# EAGLE design WS2811Controller (EAGLE 6.4)
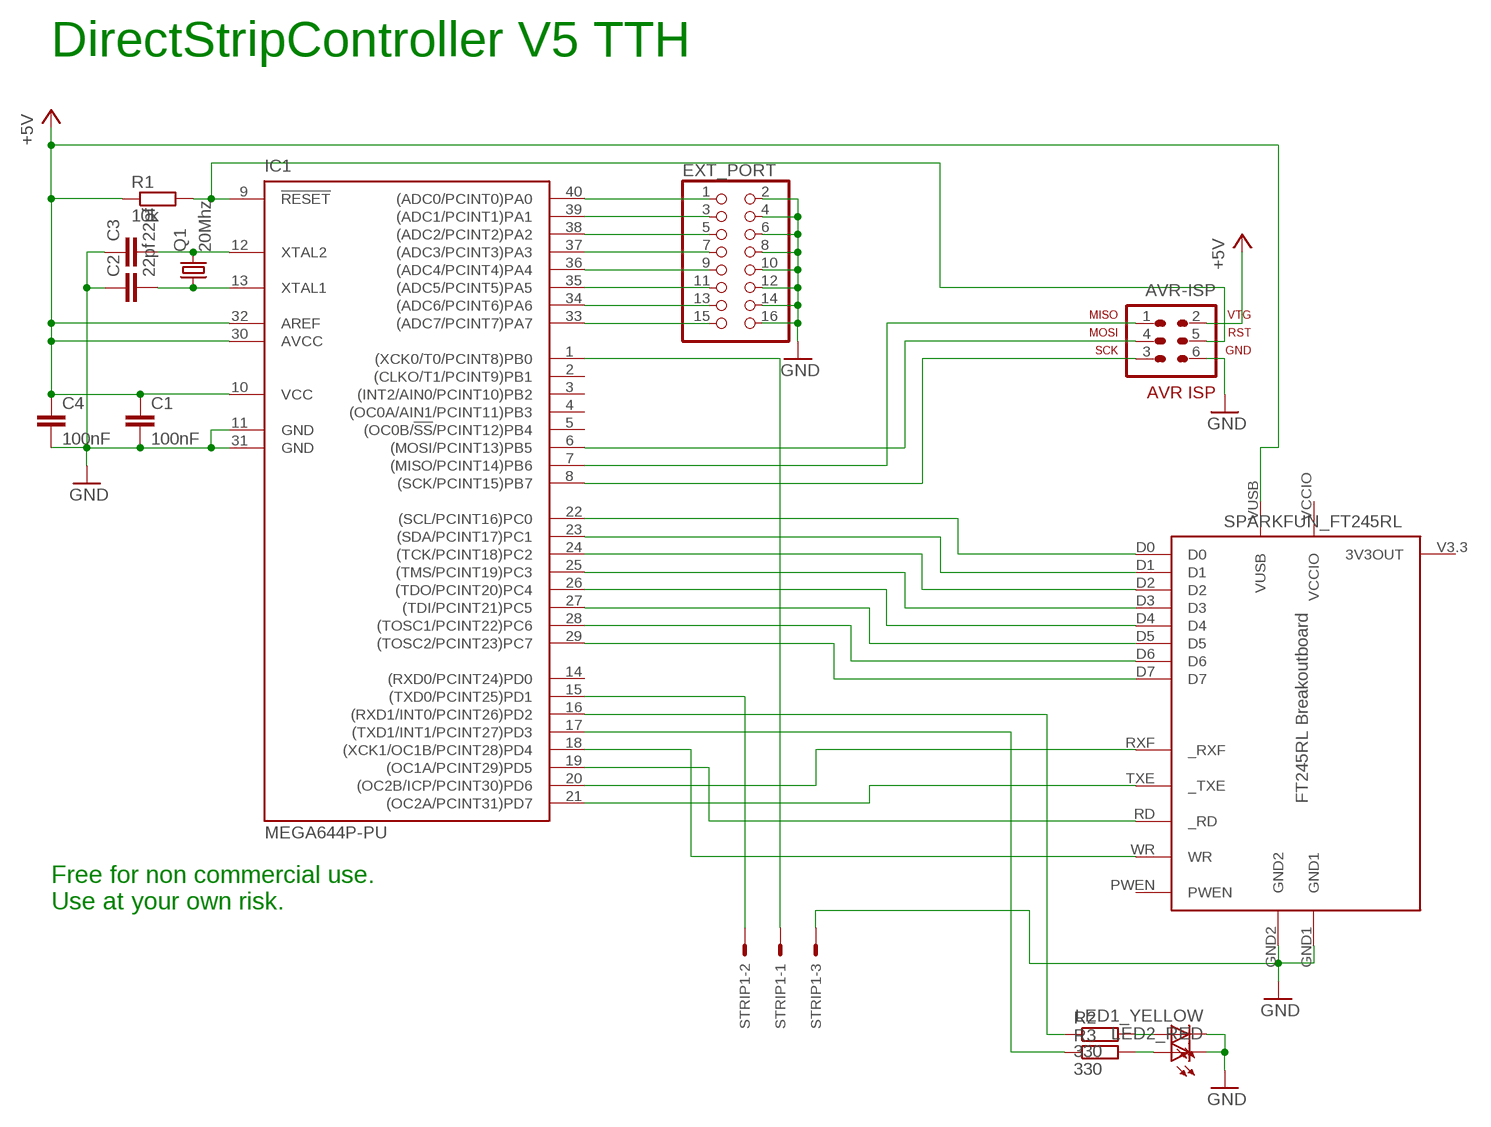
[diagram p0: schematic, sheet 1]

## Parts
AVR-ISP  AVR-ISP-6  [AVR-ISP-6]
C1  100nF  C-EU025-025X050  [C025-025X050]
C2  22pf  C-EU025-025X050  [C025-025X050]
C3  22pf  C-EU025-025X050  [C025-025X050]
C4  100nF  C-EU025-025X050  [C025-025X050]
EXT_PORT  PINHD-2X8  [2X08]
IC1  MEGA644P-PU  MEGA164P/324P/644P-PU  [DIL40]
LED1_YELLOW  LED3MM  [LED3MM]
LED2_RED  LED3MM  [LED3MM]
Q1  20Mhz  CRYSTALHC49U-V  [HC49U-V]
R1  10k  R-EU_0207/10  [0207/10]
R2  330  R-EU_0207/10  [0207/10]
R3  330  R-EU_0207/10  [0207/10]
SPARKFUN_FT245RL  FT245RL_BREAKOUTBOARD  [SPARKFUN_FT245RL_BOARD]
STRIP1  22-27-2031-03  [6410-03]

## Nets
+5V: AVR-ISP.2 C1.1 C4.1 IC1.10(VCC) IC1.30(AVCC) IC1.32(AREF) R1.1 SPARKFUN_FT245RL.VUSB
DATA0: IC1.22((SCL/PCINT16)PC0) SPARKFUN_FT245RL.D0
DATA1: IC1.23((SDA/PCINT17)PC1) SPARKFUN_FT245RL.D1
DATA2: IC1.24((TCK/PCINT18)PC2) SPARKFUN_FT245RL.D2
DATA3: IC1.25((TMS/PCINT19)PC3) SPARKFUN_FT245RL.D3
DATA4: IC1.26((TDO/PCINT20)PC4) SPARKFUN_FT245RL.D4
DATA5: IC1.27((TDI/PCINT21)PC5) SPARKFUN_FT245RL.D5
DATA6: IC1.28((TOSC1/PCINT22)PC6) SPARKFUN_FT245RL.D6
DATA7: IC1.29((TOSC2/PCINT23)PC7) SPARKFUN_FT245RL.D7
GND: AVR-ISP.6 C1.2 C2.1 C3.1 C4.2 EXT_PORT.2 EXT_PORT.4 EXT_PORT.6 EXT_PORT.8 EXT_PORT.10 EXT_PORT.12 EXT_PORT.14 EXT_PORT.16 IC1.11(GND) IC1.31(GND) LED1_YELLOW.K(C) LED2_RED.K(C) SPARKFUN_FT245RL.GND1 SPARKFUN_FT245RL.GND2 STRIP1.3
MISO: AVR-ISP.1 IC1.7((MISO/PCINT14)PB6)
MOSI: AVR-ISP.4 IC1.6((MOSI/PCINT13)PB5)
N$3: IC1.16((RXD1/INT0/PCINT26)PD2) R2.1
N$6: IC1.17((TXD1/INT1/PCINT27)PD3) R3.1
N$8: C2.2 IC1.13(XTAL1) Q1.1
N$9: C3.2 IC1.12(XTAL2) Q1.2
N$21: LED1_YELLOW.A R2.2
N$22: LED2_RED.A R3.2
N$24: EXT_PORT.1 IC1.40((ADC0/PCINT0)PA0)
N$26: EXT_PORT.3 IC1.39((ADC1/PCINT1)PA1)
N$27: EXT_PORT.5 IC1.38((ADC2/PCINT2)PA2)
N$28: EXT_PORT.7 IC1.37((ADC3/PCINT3)PA3)
N$29: EXT_PORT.9 IC1.36((ADC4/PCINT4)PA4)
N$30: EXT_PORT.11 IC1.35((ADC5/PCINT5)PA5)
N$31: EXT_PORT.13 IC1.34((ADC6/PCINT6)PA6)
N$32: EXT_PORT.15 IC1.33((ADC7/PCINT7)PA7)
RD: IC1.19((OC1A/PCINT29)PD5) SPARKFUN_FT245RL.RD(_RD)
RESET: AVR-ISP.5 IC1.9(!RESET) R1.2
RXF: IC1.20((OC2B/ICP/PCINT30)PD6) SPARKFUN_FT245RL.RXF(_RXF)
SCK: AVR-ISP.3 IC1.8((SCK/PCINT15)PB7)
STRIP_CLOCK: IC1.1((XCK0/T0/PCINT8)PB0) STRIP1.1
STRIP_DATA: IC1.15((TXD0/PCINT25)PD1) STRIP1.2
TXE: IC1.21((OC2A/PCINT31)PD7) SPARKFUN_FT245RL.TXE(_TXE)
WR: IC1.18((XCK1/OC1B/PCINT28)PD4) SPARKFUN_FT245RL.WR
Unconnected: IC1.2((CLKO/T1/PCINT9)PB1) IC1.3((INT2/AIN0/PCINT10)PB2) IC1.4((OC0A/AIN1/PCINT11)PB3) IC1.5((OC0B/!SS!/PCINT12)PB4) IC1.14((RXD0/PCINT24)PD0) SPARKFUN_FT245RL.PWEN SPARKFUN_FT245RL.V3.3(3V3OUT)

## Notes on the sheet
- DirectStripController V5 TTH
- Free for non commercial use.
  Use at your own risk.

## Power pins joined to a net without a drawn wire
VCCIO: SPARKFUN_FT245RL.VCCIO

## Library data of the parts
AVR-ISP = 0_avr:AVR-ISP-6: AVR ISP-6 Serial Programming Header
C1-C4 = 0_Standard-Parts:C-EU: CAPACITOR, European symbol
EXT_PORT = 0_pinhead:PINHD-2X8: PIN HEADER
IC1 = 0_avr:MEGA164P/324P/644P-PU
LED1_YELLOW LED2_RED = 0_Led:LED: LED
Q1 = 0_tom parts:CRYSTAL: CRYSTAL; OC_FARNELL: 1666969; OC_NEWARK: unknown
R1-R3 = 0_Standard-Parts:R-EU_: RESISTOR, European symbol
SPARKFUN_FT245RL = Sparkfun:FT245RL_BREAKOUTBOARD: Sparkfun FT245RL Breakoutboard
STRIP1 = con-molex:22-?-03: CONNECTOR wire to board 2.54 mm (.1 inch) pitch header; OC_FARNELL: unknown; OC_NEWARK: unknown

## Board
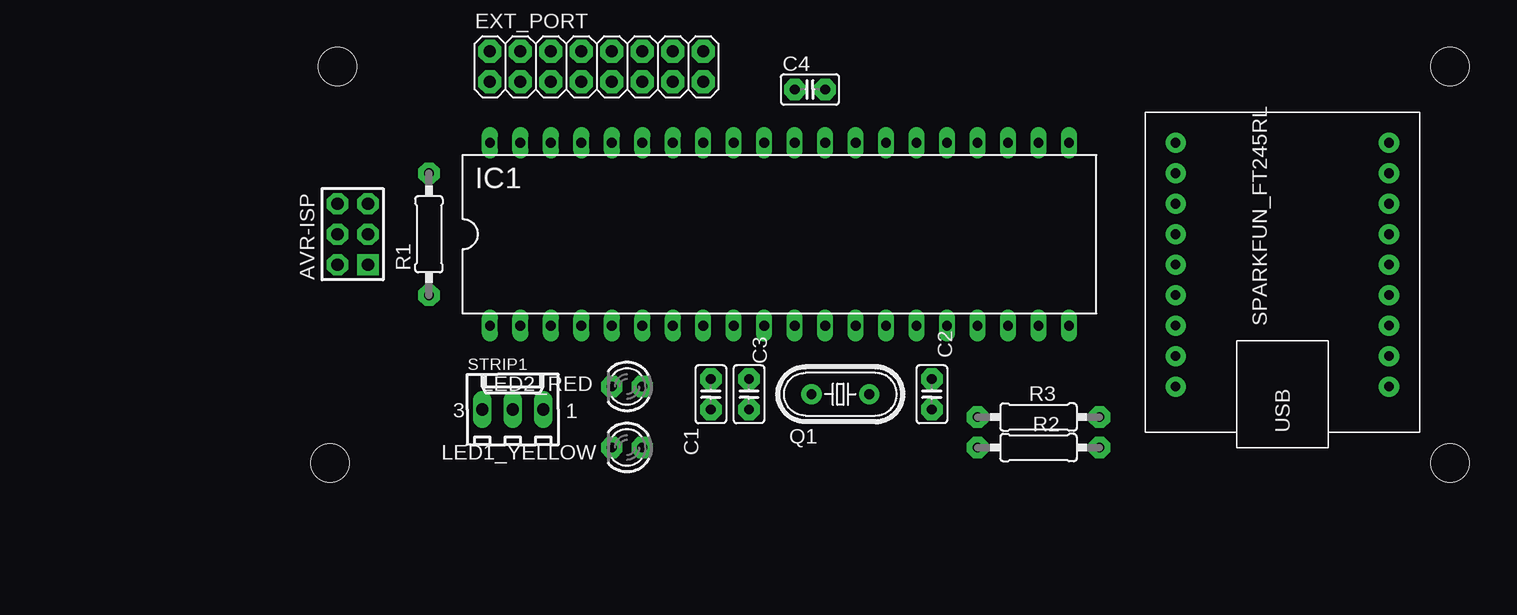
[diagram p1: board, top side]
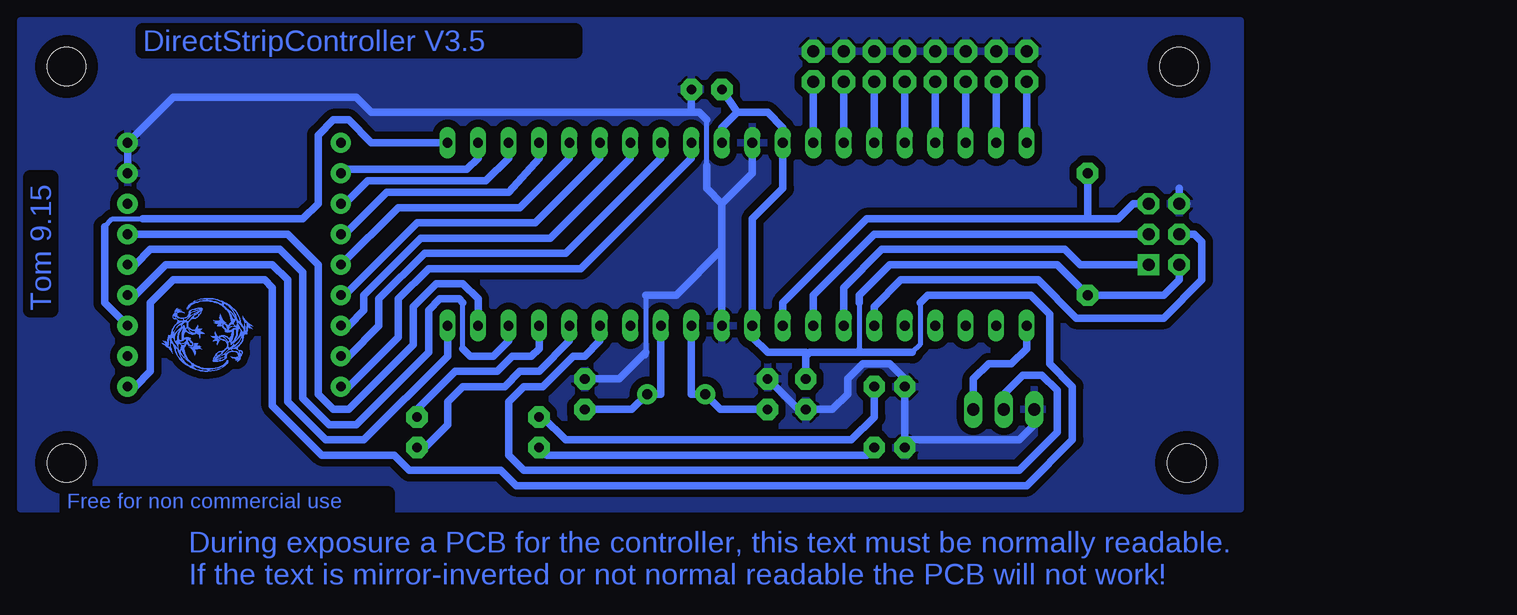
[diagram p2: board, bottom side, seen from below]

No outline drawn. Coordinates in mm, seen from the top.
Copper layers (1*16): Top 0.035mm / dielectric 1.5mm / Bottom 0.035mm
Design rules "default": minimum track width 10mil, minimum drill 24mil, track to track 8mil, track to pad 8mil, pad to pad 8mil, via to via 8mil, smd to smd 8mil, copper to edge 40mil, drill to drill 8mil, minimum pad ring 10mil, minimum via ring 8mil, stop-mask expansion 4mil, vias tented up to drill 0mil, thermal gap 10mil
Holes 3.2 mm at 5.08,36.83 4.45,3.81 97.79,3.81 97.79,36.83

### Footprints (pad centres in the part's own frame; a part is rotated, then mirrored left to right if it is on the bottom)
AVR-ISP-6 = drill 1.016 pad 1.778 square: 1 -2.54,-1.27 | drill 1.016 pad 1.778 octagon: 2 -2.54,1.27; 3 0,-1.27; 4 0,1.27; 5 2.54,-1.27; 6 2.54,1.27
C025-025X050 = drill 0.813 pad 1.778 octagon: 1 -1.27,0; 2 1.27,0
2X08 = drill 1.016 pad 1.93 octagon: 1 -8.89,-1.27; 2 -8.89,1.27; 3 -6.35,-1.27; 4 -6.35,1.27; 5 -3.81,-1.27; 6 -3.81,1.27; 7 -1.27,-1.27; 8 -1.27,1.27; 9 1.27,-1.27; 10 1.27,1.27; 11 3.81,-1.27; 12 3.81,1.27; 13 6.35,-1.27; 14 6.35,1.27; 15 8.89,-1.27; 16 8.89,1.27
DIL40 = drill 0.813 long: 1 -24.13,-7.62; 2 -21.59,-7.62; 3 -19.05,-7.62; 4 -16.51,-7.62; 5 -13.97,-7.62; 6 -11.43,-7.62; 7 -8.89,-7.62; 8 -6.35,-7.62; 9 -3.81,-7.62; 10 -1.27,-7.62; 11 1.27,-7.62; 12 3.81,-7.62; 13 6.35,-7.62; 14 8.89,-7.62; 15 11.43,-7.62; 16 13.97,-7.62; 17 16.51,-7.62; 18 19.05,-7.62; 19 21.59,-7.62; 20 24.13,-7.62; 21 24.13,7.62; 22 21.59,7.62; 23 19.05,7.62; 24 16.51,7.62; 25 13.97,7.62; 26 11.43,7.62; 27 8.89,7.62; 28 6.35,7.62; 29 3.81,7.62; 30 1.27,7.62; 31 -1.27,7.62; 32 -3.81,7.62; 33 -6.35,7.62; 34 -8.89,7.62; 35 -11.43,7.62; 36 -13.97,7.62; 37 -16.51,7.62; 38 -19.05,7.62; 39 -21.59,7.62; 40 -24.13,7.62
LED3MM = drill 0.813 pad 1.778 octagon: A -1.27,0; K 1.27,0
HC49U-V = drill 0.813 pad 1.676: 1 -2.413,0; 2 2.413,0
0207/10 = drill 0.813 pad 1.778 octagon: 1 -5.08,0; 2 5.08,0
SPARKFUN_FT245RL_BOARD = drill 0.8 pad 1.676: D0 7.62,8.89; D1 5.08,8.89; D2 2.54,8.89; D3 0,8.89; D4 -2.54,8.89; D5 -5.08,8.89; D6 -7.62,8.89; D7 -10.16,8.89; GND1 7.62,-8.89; GND2 10.16,-8.89; PWEN 5.08,-8.89; RD 2.54,-8.89; RXF -2.54,-8.89; TXE -5.08,-8.89; V3.3 -7.62,-8.89; VCCIO 10.16,8.89; VUSB -10.16,-8.89; WR 0,-8.89
6410-03 = drill 1.016 long: 1 2.54,0; 2 0,0; 3 -2.54,0

### Placement (x,y rotation side)
AVR-ISP  6.35,22.86 90 top
C1  36.2,9.53 270 top
C2  54.61,9.53 270 top
C3  39.37,9.53 270 top
C4  44.45,34.92 0 top
EXT_PORT  26.67,36.83 0 top
IC1  41.91,22.86 0 top
LED1_YELLOW  29.21,5.08 180 top
LED2_RED  29.21,10.16 180 top
Q1  46.99,9.53 180 top
R1  12.7,22.86 90 top
R2  63.5,5.08 180 top
R3  63.5,7.62 180 top
SPARKFUN_FT245RL  83.82,20.32 90 top
STRIP1  19.68,8.26 0 top
U$1  [BOTTOM_DOUBLE_LIZARD_300]  82.55,11.43 0 top

### Tracks (layer width: path | path; a pad name or v marks a point on that pad's centre or on a via)
+5V
  Bottom 0.406: 26.67,17.14 26.67,13.65 27.3,13.02 | 31.75,17.14 31.75,13.34 31.43,13.02
  Bottom 0.61: AVR-ISP.2 5.08,19.05 6.35,17.78 R1.1 15.24,20.32 29.21,20.32 31.75,17.78 31.75,17.14 | 41.91,33.02 39.37,33.02 38.1,31.75 IC1.32 38.1,26.67 40.64,24.13 IC1.10 40.64,14.29 39.37,13.02 36.2,13.02 36.2,12.7 | 41.91,33.02 43.18,31.75 IC1.30 | C4.1 41.91,33.02 | 26.67,17.14 26.04,17.78 17.46,17.78 15.88,16.19 15.88,12.06 13.97,10.16 13.97,5.71 17.78,1.91 60.33,1.91 61.59,3.17 69.22,3.17 70.48,4.45 76.52,4.45 80.64,8.57 80.64,18.41 81.28,19.05 88.9,19.05 90.81,17.14 90.81,11.43 92.08,10.16 SPARKFUN_FT245RL.VUSB | C1.1 36.2,12.7 | 27.3,13.02 31.43,13.02 35.88,13.02 36.2,12.7
DATA0
  Bottom 0.61: IC1.22 63.5,29.21 64.45,28.26 74.61,28.26 SPARKFUN_FT245RL.D0
DATA1
  Bottom 0.61: IC1.23 60.96,29.21 62.87,27.3 72.71,27.3 74.61,25.4 SPARKFUN_FT245RL.D1
DATA2
  Bottom 0.61: IC1.24 58.42,29.21 60.96,26.35 71.12,26.35 74.61,22.86 SPARKFUN_FT245RL.D2
DATA3
  Bottom 0.61: IC1.25 55.88,29.21 60.01,25.08 70.17,25.08 SPARKFUN_FT245RL.D3
DATA4
  Bottom 0.61: IC1.26 53.34,29.21 58.74,23.81 68.58,23.81 74.61,17.78 SPARKFUN_FT245RL.D4
DATA5
  Bottom 0.61: IC1.27 50.8,29.21 57.47,22.54 68.26,22.54 73.03,17.78 73.03,16.51 74.3,15.24 SPARKFUN_FT245RL.D5
DATA6
  Bottom 0.61: IC1.28 48.26,29.21 56.2,21.27 67.94,21.27 71.75,17.46 71.75,15.24 74.3,12.7 SPARKFUN_FT245RL.D6
DATA7
  Bottom 0.61: IC1.29 45.72,29.21 54.93,20 67.63,20 70.17,17.46 70.17,14.29 74.3,10.16 SPARKFUN_FT245RL.D7
GND
  Bottom 0.406: 44.45,28.57 44.45,32.38 | 49.53,17.78 49.53,13.02 49.53,12.7
  Bottom 0.61: IC1.11 43.18,21.59 | 43.18,21.59 43.18,25.4 | IC1.31 40.64,27.94 43.18,25.4 | SPARKFUN_FT245RL.GND1 SPARKFUN_FT245RL.GND2 88.9,34.29 73.66,34.29 72.39,33.02 45.72,33.02 | 43.18,25.4 44.45,26.67 44.45,28.57 | 45.72,33.02 45.09,33.02 44.45,32.38 | 4.45,25.4 AVR-ISP.6 5.08,26.67 | 43.18,21.59 46.99,17.78 49.53,17.78 | C4.2 45.72,33.02 | 49.53,13.02 51.75,10.79 C2.1 | 27.94,5.71 LED2_RED.K 27.94,10.79 29.21,12.06 31.43,12.06 32.7,10.79 32.7,9.53 33.97,8.26 C1.2 36.83,8.26 C3.1 | 27.94,5.71 LED1_YELLOW.K | STRIP1.3 17.14,6.99 18.41,5.71 27.94,5.71
  pour Bottom (isolate 0.61): 0,0 0,40.64 101.6,40.64 101.6,0
MISO
  Bottom 0.61: AVR-ISP.1 13.34,20.32 14.61,21.59 29.84,21.59 33.02,18.41 IC1.7
MOSI
  Bottom 0.61: AVR-ISP.4 3.81,22.86 3.17,22.23 3.17,19.05 6.35,15.88 13.65,15.88 16.83,19.05 28.26,19.05 30.48,16.83 IC1.6
N$3
  Bottom 0.61: IC1.16 55.88,13.97 58.42,11.43 60.01,11.43 61.28,10.16 64.77,10.16 66.04,8.89 66.04,6.99 67.94,5.08 R2.1
N$6
  Bottom 0.61: IC1.17 58.42,13.34 59.05,12.7 60.64,12.7 61.91,11.43 65.41,11.43 68.58,8.26 R3.1
N$8
  Bottom 0.61: IC1.13 48.26,9.53 Q1.1 50.67,8.26 C2.2
N$9
  Bottom 0.61: IC1.12 45.72,9.53 Q1.2 43.31,8.26 C3.2
N$21
  Bottom 0.61: LED1_YELLOW.A 31.11,4.45 57.78,4.45 R2.2
N$22
  Bottom 0.61: R3.2 58.1,7.62 56.2,5.71 32.38,5.71 30.48,7.62 LED2_RED.A
N$24
  Bottom 0.61: EXT_PORT.1 IC1.40
N$26
  Bottom 0.61: EXT_PORT.3 IC1.39
N$27
  Bottom 0.61: EXT_PORT.5 IC1.38
N$28
  Bottom 0.61: EXT_PORT.7 IC1.37
N$29
  Bottom 0.61: EXT_PORT.9 IC1.36
N$30
  Bottom 0.61: EXT_PORT.11 IC1.35
N$31
  Bottom 0.61: EXT_PORT.13 IC1.34
N$32
  Bottom 0.61: EXT_PORT.15 IC1.33
RD
  Bottom 0.61: IC1.19 63.5,17.46 64.77,18.73 66.99,18.73 68.9,16.83 68.9,13.65 74.3,8.26 75.56,8.26 76.83,9.53 76.83,20.32 79.38,22.86 SPARKFUN_FT245RL.RD
RESET
  Bottom 0.61: IC1.9 38.1,17.14 31.11,24.13 12.7,24.13 | AVR-ISP.5 8.89,25.4 10.16,24.13 12.7,24.13 | R1.2 12.7,24.13
RXF
  Bottom 0.61: IC1.20 66.04,12.7 73.03,5.71 76.2,5.71 79.38,8.89 79.38,19.05 80.64,20.32 89.53,20.32 92.08,17.78 SPARKFUN_FT245RL.RXF
SCK
  Bottom 0.61: AVR-ISP.3 30.48,22.86 35.56,17.78 IC1.8
STRIP_CLOCK
  Bottom 0.61: STRIP1.1 22.23,10.79 20.95,12.06 19.05,12.06 17.78,13.34 IC1.1
STRIP_DATA
  Bottom 0.61: IC1.15 53.34,13.97 54.61,12.7 55.56,12.7 58.1,10.16 59.69,10.16 60.96,8.89 60.96,4.45 59.69,3.17 18.41,3.17 15.24,6.35 15.24,9.84 16.51,11.11 18.1,11.11 19.68,9.53 STRIP1.2
TXE
  Bottom 0.406: 94.61,23.5 93.98,24.13 91.44,24.13
  Bottom 0.61: IC1.21 72.39,30.48 74.3,32.38 75.56,32.38 76.83,31.11 76.83,25.4 78.11,24.13 91.44,24.13 | SPARKFUN_FT245RL.TXE 94.61,17.14 94.61,23.5
WR
  Bottom 0.406: 64.77,13.34 64.77,17.14
  Bottom 0.61: IC1.18 60.96,13.97 62.23,12.7 64.14,12.7 64.77,13.34 | 64.77,17.14 65.09,17.46 66.67,17.46 67.63,16.51 67.63,13.02 73.66,6.99 75.88,6.99 78.11,9.21 78.11,19.68 80.01,21.59 90.81,21.59 92.08,20.32 SPARKFUN_FT245RL.WR

### Text on the board
Bottom: DirectStripController V3.5 | Tom 9.15 | Free for non commercial use | During exposure a PCB for the controller, this text must be normally readable. / If the text is mirror-inverted or not normal readable the PCB will not work!